# Altium project ESC.PrjPcb
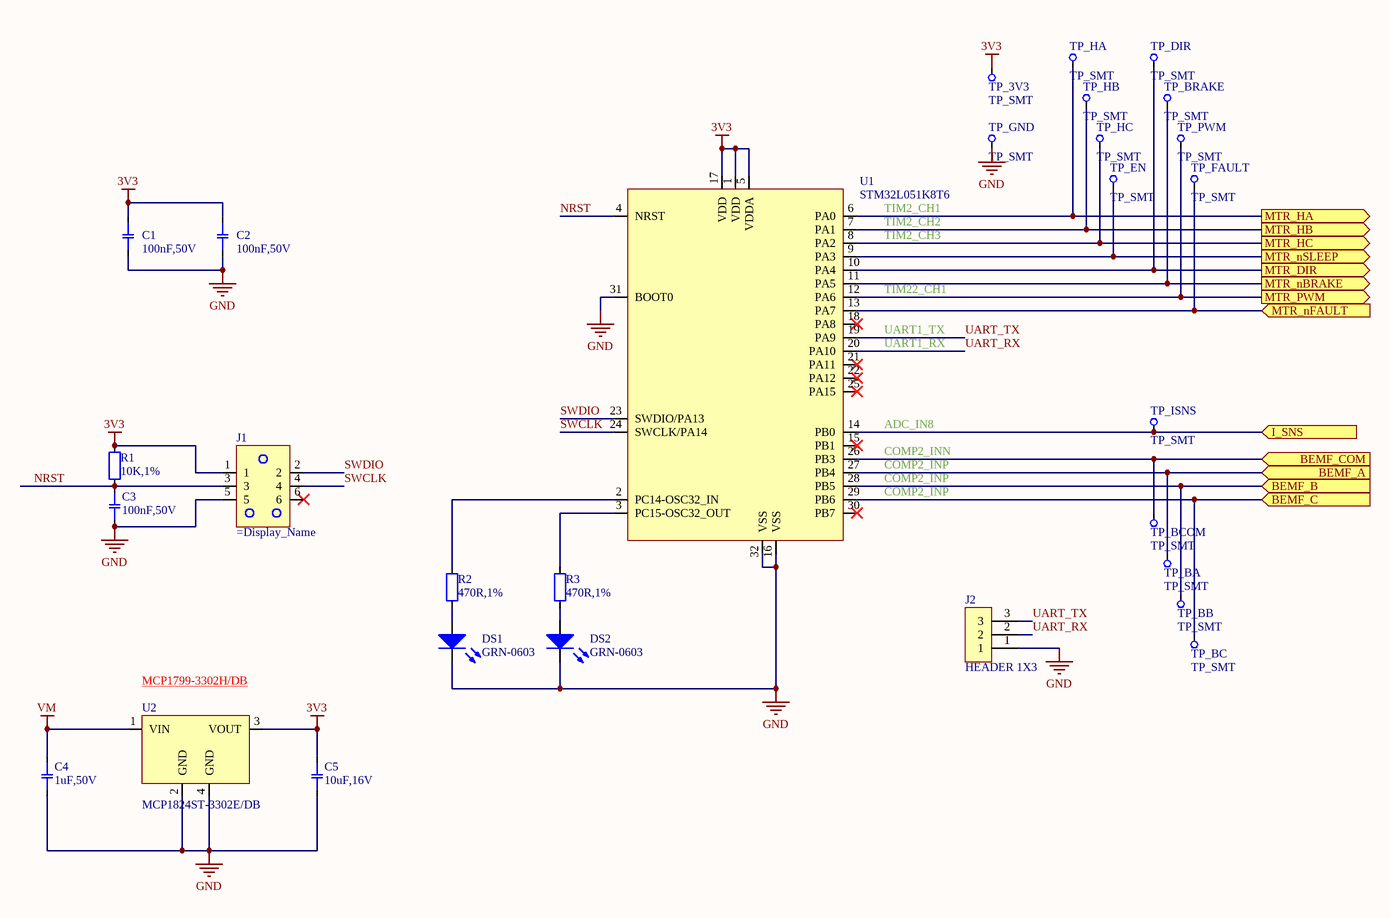
[diagram p0: MCU.SchDoc]
Project_Board_Name: Busmaster; Project_Revision: 1.0
2 sheets, 68 parts. Net scope: flat (ports and power ports of the same name join across sheets).
Board file: ESC.PcbDoc
Sheets:
  MCU.SchDoc
  ESC.SchDoc

## Sheet MCU.SchDoc: Top Level
size A3; CompanyName: NOT USED; DocumentNumber: 1; SheetNumber: 1; SheetTotal: 2; PageSetup: Record=PageOptions|CenterHorizontal=True|CenterVertical=True|PrintScale=1.00|XCorrection=1.00|YCorrection=1.00|PrintKind=0|BorderSize=5000000|LeftOffset=0|BottomOffset=0|Orientation=2|PaperLength=1000|PaperWidth=1000|Scale=100|PaperSource=7|PrintQuality=-4|MediaType=1|DitherType=10|PaperKind=A3|PrintScaleMode=0

### Parts
C1  100nF,50V  [CAPC1608X09N_0603]
C2  100nF,50V  [CAPC1608X09N_0603]
C3  100nF,50V  [CAPC1608X09N_0603]
C4  1uF,50V  [CAPC1608X09N_0603]
C5  10uF,16V  [CAPC2012X12N_0805]
DS1  GRN-0603  [LED_SML-LX0603]
DS2  GRN-0603  [LED_SML-LX0603]
J1  (no value)  [TAG-CONNECT_TC2030-IDC]  (no BOM)
J2  HEADER 1X3  [HIROSE_A2-3PA-2.54DSA]
R1  10K,1%  [RESC1608X06N_0603]
R2  470R,1%  [RESC1608X06N_0603]
R3  470R,1%  [RESC1608X06N_0603]
TP_3V3  TP_SMT  [TP_100X200]
TP_BA  TP_SMT  [TP_100X200]
TP_BB  TP_SMT  [TP_100X200]
TP_BC  TP_SMT  [TP_100X200]
TP_BCOM  TP_SMT  [TP_100X200]
TP_BRAKE  TP_SMT  [TP_100X200]
TP_DIR  TP_SMT  [TP_100X200]
TP_EN  TP_SMT  [TP_100X200]
TP_FAULT  TP_SMT  [TP_100X200]
TP_GND  TP_SMT  [TP_100X200]
TP_HA  TP_SMT  [TP_100X200]
TP_HB  TP_SMT  [TP_100X200]
TP_HC  TP_SMT  [TP_100X200]
TP_ISNS  TP_SMT  [TP_100X200]
TP_PWM  TP_SMT  [TP_100X200]
U1  STM32L051K8T6  [LQFP32]
U2  MCP1824ST-3302E/DB  [SOT230P700X180-4N_SOT223-3]

### Ports
BEMF_A (in), BEMF_B (in), BEMF_C (in), BEMF_COM (in), I_SNS (in), MTR_DIR (out), MTR_HA (out), MTR_HB (out), MTR_HC (out), MTR_nBRAKE (out), MTR_nFAULT (in), MTR_nSLEEP (out), MTR_PWM (out)

### Nets
3V3: C1.2 C2.2 C5.2 J1.1 R1.2 TP_3V3.1 U1.1(VDD) U1.5(VDDA) U1.17(VDD) U2.3(VOUT)
GND: C1.1 C2.1 C3.2 C4.1 C5.1 DS1.1(C) DS2.1(C) J1.5 J2.1 TP_GND.1 U1.16(VSS) U1.31(BOOT0) U1.32(VSS) U2.2(GND) U2.4(GND)
VM: C4.2 U2.1(VIN)
NRST: C3.1 J1.3 R1.1 U1.4(NRST)
SWCLK: J1.4 U1.24(SWCLK/PA14)
SWDIO: J1.2 U1.23(SWDIO/PA13)
UART_RX: J2.2 U1.20(PA10)
UART_TX: J2.3 U1.19(PA9)
NetC15_2: TP_BC.1 U1.29(PB6) ; port BEMF_C
NetC16_2: TP_BB.1 U1.28(PB5) ; port BEMF_B
NetC17_2: TP_BA.1 U1.27(PB4) ; port BEMF_A
NetC18_2: TP_BCOM.1 U1.26(PB3) ; port BEMF_COM
NetC19_1: TP_ISNS.1 U1.14(PB0) ; port I_SNS
NetDS1_2: DS1.2(A) R2.1
NetDS2_2: DS2.2(A) R3.1
NetR2_2: R2.2 U1.2(PC14-OSC32_IN)
NetR3_2: R3.2 U1.3(PC15-OSC32_OUT)
NetTP_BRAKE_1: TP_BRAKE.1 U1.11(PA5) ; port MTR_nBRAKE
NetTP_DIR_1: TP_DIR.1 U1.10(PA4) ; port MTR_DIR
NetTP_EN_1: TP_EN.1 U1.9(PA3) ; port MTR_nSLEEP
NetTP_FAULT_1: TP_FAULT.1 U1.13(PA7) ; port MTR_nFAULT
NetTP_HA_1: TP_HA.1 U1.6(PA0) ; port MTR_HA
NetTP_HB_1: TP_HB.1 U1.7(PA1) ; port MTR_HB
NetTP_HC_1: TP_HC.1 U1.8(PA2) ; port MTR_HC
NetTP_PWM_1: TP_PWM.1 U1.12(PA6) ; port MTR_PWM

Not connected (* = marked no-connect by the designer): J1 6*; U1 15(PB1)* 18(PA8)* 21(PA11)* 22(PA12)* 25(PA15)* 30(PB7)*

### Notes on the sheet
- (near U1) TIM2_CH1
- (near U1) TIM2_CH2
- (near U1) TIM2_CH3
- (near U1) TIM22_CH1
- (near U1) UART1_TX
- (near U1) UART1_RX
- (near U1) COMP2_INN
- (near U1) ADC_IN8
- (near U1) COMP2_INP
- (near U2) MCP1799-3302H/DB <https://www.digikey.co.nz/product-detail/en/microchip-technology/MCP1799-3302H-DB/150-MCP1799-3302H-DB-ND/10491984>
- Project
- Size:
- Date:
- A3
- Revision:
- Sheet
- of
- Lambo
- File:

### Library data of the parts
C1-C3 = CCH-104CH-G: CAP CER 0.1UF 50V 10% X7R 0603; Manufacturer: Kemet; Manufacturer Part Number: C0603C104K5RACTU; Type: Ceramic; Display_Name: 100nF,50V; Capacitance: 100nF; Dielectric: X7R; Tolerance: 10%; Voltage: 50V; BWA PN: CCH-104CH-G; Schematic Symbol: CAP-NP_1; Supplier 1: Digi-Key; Supplier Part Number 1: 399-5089-1-ND
C4 = CCH-106DH-G-A: AUTOMOTIVE CAP CER 1UF 50V 10% X5R 0603; Manufacturer: TDK Corporation; Manufacturer Part Number: CGA3E3X5R1H105K080AB; Type: Ceramic; Display_Name: 1uF,50V; Capacitance: 1uF; Dielectric: X5R; Tolerance: 10%; Voltage: 50V; BWA PN: CCH-106DH-G-A; Schematic Symbol: CAP-NP_1; Supplier 1: Digi-Key; Supplier Part Number 1: 445-7878-1-ND
C5 = CCI-106CE-G: CAP CER 10µF ±10% 16V X7R 0805; Manufacturer: Samsung Electro-Mechanics America, Inc.; Manufacturer Part Number: CL21B106KOQNNNG; Type: Ceramic; Display_Name: 10uF,16V; Capacitance: 10uF; Dielectric: X7R; Tolerance: 10%; Voltage: 16V; BWA PN: CCI-106CE-G; Schematic Symbol: CAP-NP_1; Supplier 1: Digi-Key; Supplier Part Number 1: 1276-6472-1-ND
DS1 DS2 = LED-10087-A: LED GREEN CLEAR 0603 SMD; Manufacturer: Dialight; Manufacturer Part Number: 5988081107F; Wavelength: 523nm; Axial Intensity: 300mcd; If(max): 20mA; Lens Style/Size: 0603; Vf@I: 3.2V; Viewing Angle: 140; Display_Name: GRN-0603; BWA PN: LED-10087-A; Colour: GREEN; Lens type: clear; Vr(max): -; Schematic Symbol: LED_1; Supplier 1: Digi-Key; Supplier Part Number 1: 350-2036-1-ND
J1 = NONPART-051: Tag connect 6 way; Schematic Symbol: TAGCON_TC2030-IDC; BWA PN: NONPART-051
J2 = CON-10038-A: CONN 3-pin 2.54mm pitch TH single row; Manufacturer: Hirose; Manufacturer Part Number: A2-3PA-2.54DSA; Contacts: 3; Rows: 1; Display_Name: HEADER 1X3; Pitch: 2.54mm; Type: HEADER; BWA PN: CON-10038-A; Schematic Symbol: HIROSE_A2-3PA-2.54DSA
R1 = RSH-10K00-D: RES 10.0K OHM 1/10W 1% 0603 SMD; Manufacturer: Yageo; Manufacturer Part Number: RC0603FR-0710KL; Power: 0.1W; Display_Name: 10K,1%; Resistance: 10K; Tolerance: 1%; Type: Chip; BWA PN: RSH-10K00-D; Schematic Symbol: RESISTOR_1; Supplier 1: Digi-Key; Supplier Part Number 1: 311-10.0KHRCT-ND
R2 R3 = RSH-470R0-D: RES 470 OHM 1/10W 1% 0603 SMD; Manufacturer: Rohm Semiconductor; Manufacturer Part Number: MCR03EZPFX4700; Power: 0.1W; Display_Name: 470R,1%; Resistance: 470R; Tolerance: 1%; Type: Chip; BWA PN: RSH-470R0-D; Schematic Symbol: RESISTOR_1; Supplier 1: Digi-Key; Supplier Part Number 1: RHM470HCT-ND
TP_3V3 TP_BA TP_BB TP_BC TP_BCOM TP_BRAKE TP_DIR TP_EN TP_FAULT TP_GND TP_HA TP_HB TP_HC TP_ISNS TP_PWM = NONPART-060: Test Point - SMT; Display_Name: TP_SMT; BWA PN: NONPART-060; Schematic Symbol: TP_1
U1 = ICT-10696-A: 32 Bit Mcirocontroler; Manufacturer: ST Microelectronics; Temp Range: -40°C ~ 85°C; Display_Name: STM32L051K8T6; BWA PN: ICT-10696-A; Schematic Symbol: STM32L051x6/8; Manufacturer Part Number: STM32L051K8T6; Supplier 1: Digi-Key; Supplier Part Number 1: 497-14901-ND
U2 = ICT-10417-A: IC LDO REG 300MA 3.3V SOT223-3; Manufacturer: Microchip Technology; Temp Range: -40°C ~ 125°C; Display_Name: MCP1824ST-3302E/DB; BWA PN: ICT-10417-A; Schematic Symbol: MCP1824ST_DB; Manufacturer Part Number: MCP1824ST-3302E/DB; Supplier 1: Digi-Key; Supplier Part Number 1: MCP1824ST-3302E/DBCT-ND

## Sheet ESC.SchDoc: Top Level
size A3; CompanyName: NOT USED; DocumentNumber: 2; SheetNumber: 2; SheetTotal: 2; PageSetup: Record=PageOptions|CenterHorizontal=True|CenterVertical=True|PrintScale=1.00|XCorrection=1.00|YCorrection=1.00|PrintKind=0|BorderSize=5000000|LeftOffset=0|BottomOffset=0|Orientation=2|PaperLength=1000|PaperWidth=1000|Scale=100|PaperSource=7|PrintQuality=-4|MediaType=1|DitherType=10|PaperKind=A3|PrintScaleMode=0
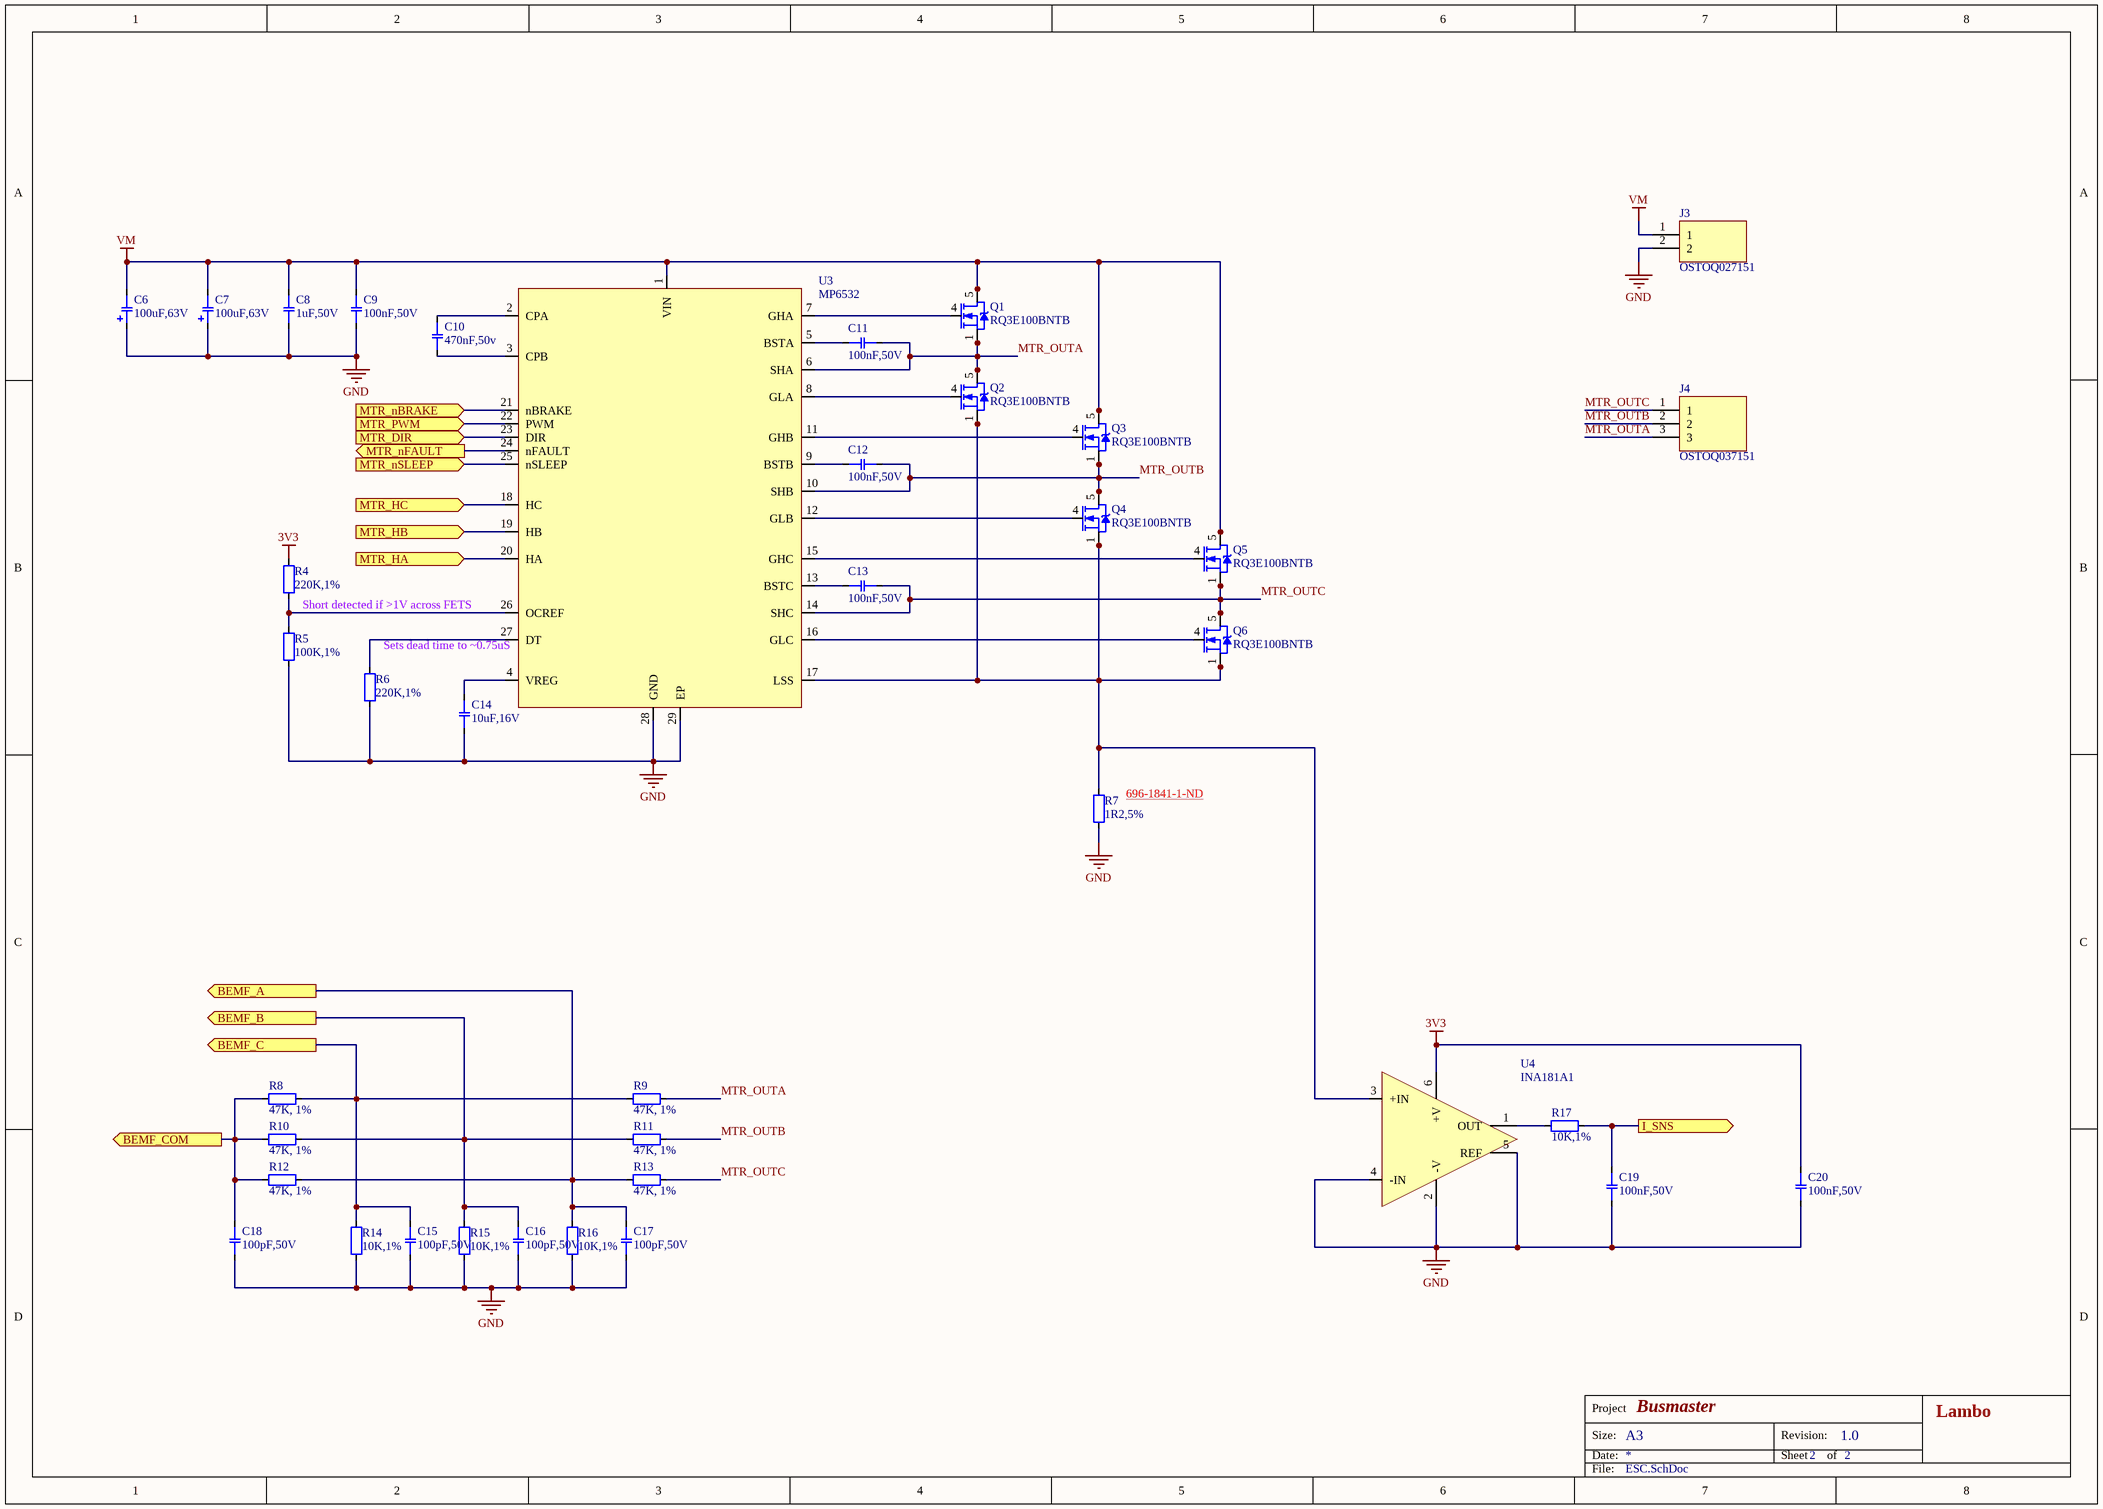
[diagram p1: ESC.SchDoc]

### Parts
C6  100uF,63V  [CAPAE1030X1020N]
C7  100uF,63V  [CAPAE1030X1020N]
C8  1uF,50V  [CAPC1608X09N_0603]
C9  100nF,50V  [CAPC1608X09N_0603]
C10  470nF,50v  [CAPC1608X09N_0603]
C11  100nF,50V  [CAPC1608X09N_0603]
C12  100nF,50V  [CAPC1608X09N_0603]
C13  100nF,50V  [CAPC1608X09N_0603]
C14  10uF,16V  [CAPC2012X12N_0805]
C15  100pF,50V  [CAPC1608X09N_0603]
C16  100pF,50V  [CAPC1608X09N_0603]
C17  100pF,50V  [CAPC1608X09N_0603]
C18  100pF,50V  [CAPC1608X09N_0603]
C19  100nF,50V  [CAPC1608X09N_0603]
C20  100nF,50V  [CAPC1608X09N_0603]
J3  OSTOQ027151  [ONSHORE_OSTOQ027151]
J4  OSTOQ037151  [ONSHORE_OSTOQ037151]
Q1  RQ3E100BNTB  [ROHM-HSMT8]
Q2  RQ3E100BNTB  [ROHM-HSMT8]
Q3  RQ3E100BNTB  [ROHM-HSMT8]
Q4  RQ3E100BNTB  [ROHM-HSMT8]
Q5  RQ3E100BNTB  [ROHM-HSMT8]
Q6  RQ3E100BNTB  [ROHM-HSMT8]
R4  220K,1%  [RESC1608X06N_0603]
R5  100K,1%  [RESC1608X06N_0603]
R6  220K,1%  [RESC1608X06N_0603]
R7  1R2,5%  [RESC6432X07N_2512]
R8  47K, 1%  [RESC1608X06N_0603]
R9  47K, 1%  [RESC1608X06N_0603]
R10  47K, 1%  [RESC1608X06N_0603]
R11  47K, 1%  [RESC1608X06N_0603]
R12  47K, 1%  [RESC1608X06N_0603]
R13  47K, 1%  [RESC1608X06N_0603]
R14  10K,1%  [RESC1608X06N_0603]
R15  10K,1%  [RESC1608X06N_0603]
R16  10K,1%  [RESC1608X06N_0603]
R17  10K,1%  [RESC1608X06N_0603]
U3  MP6532  [QFN40P400X400X100-28N_28QFN]
U4  INA181A1  [SOT95P280X145-6N_SOT23-6]

### Ports
BEMF_A (out), BEMF_B (out), BEMF_C (out), BEMF_COM (out), I_SNS (out), MTR_DIR (in), MTR_HA (in), MTR_HB (in), MTR_HC (in), MTR_nBRAKE (in), MTR_nFAULT (out), MTR_nSLEEP (in), MTR_PWM (in)

### Nets
3V3: C20.1 R4.2 U4.6(+V)
GND: C6.1(+) C7.1(+) C8.1 C9.2 C14.1 C15.1 C16.1 C17.1 C18.1 C19.2 C20.2 J3.2 R5.1 R6.1 R7.1 R14.2 R15.2 R16.2 U3.28(GND) U3.29(EP) U4.2(-V) U4.4(-IN) U4.5(REF)
VM: C6.2(-) C7.2(-) C8.2 C9.1 J3.1 Q1.5(D) Q1.6(D) Q1.7(D) Q1.8(D) Q3.5(D) Q3.6(D) Q3.7(D) Q3.8(D) Q5.5(D) Q5.6(D) Q5.7(D) Q5.8(D) U3.1(VIN)
MTR_OUTA: C11.1 J4.3 Q1.1(S) Q1.2(S) Q1.3(S) Q2.5(D) Q2.6(D) Q2.7(D) Q2.8(D) R9.2 U3.6(SHA)
MTR_OUTB: C12.1 J4.2 Q3.1(S) Q3.2(S) Q3.3(S) Q4.5(D) Q4.6(D) Q4.7(D) Q4.8(D) R11.2 U3.10(SHB)
MTR_OUTC: C13.1 J4.1 Q5.1(S) Q5.2(S) Q5.3(S) Q6.5(D) Q6.6(D) Q6.7(D) Q6.8(D) R13.2 U3.14(SHC)
NetC10_1: C10.1 U3.3(CPB)
NetC10_2: C10.2 U3.2(CPA)
NetC11_2: C11.2 U3.5(BSTA)
NetC12_2: C12.2 U3.9(BSTB)
NetC13_2: C13.2 U3.13(BSTC)
NetC14_2: C14.2 U3.4(VREG)
NetC15_2: C15.2 R8.2 R9.1 R14.1 ; port BEMF_C
NetC16_2: C16.2 R10.2 R11.1 R15.1 ; port BEMF_B
NetC17_2: C17.2 R12.2 R13.1 R16.1 ; port BEMF_A
NetC18_2: C18.2 R8.1 R10.1 R12.1 ; port BEMF_COM
NetC19_1: C19.1 R17.1 ; port I_SNS
NetQ1_4: Q1.4(G) U3.7(GHA)
NetQ2_1: Q2.1(S) Q2.2(S) Q2.3(S) Q4.1(S) Q4.2(S) Q4.3(S) Q6.1(S) Q6.2(S) Q6.3(S) R7.2 U3.17(LSS) U4.3(+IN)
NetQ2_4: Q2.4(G) U3.8(GLA)
NetQ3_4: Q3.4(G) U3.11(GHB)
NetQ4_4: Q4.4(G) U3.12(GLB)
NetQ5_4: Q5.4(G) U3.15(GHC)
NetQ6_4: Q6.4(G) U3.16(GLC)
NetR4_1: R4.1 R5.2 U3.26(OCREF)
NetR6_2: R6.2 U3.27(DT)
NetR17_2: R17.2 U4.1(OUT)
NetTP_BRAKE_1: U3.21(nBRAKE) ; port MTR_nBRAKE
NetTP_DIR_1: U3.23(DIR) ; port MTR_DIR
NetTP_EN_1: U3.25(nSLEEP) ; port MTR_nSLEEP
NetTP_FAULT_1: U3.24(nFAULT) ; port MTR_nFAULT
NetTP_HA_1: U3.20(HA) ; port MTR_HA
NetTP_HB_1: U3.19(HB) ; port MTR_HB
NetTP_HC_1: U3.18(HC) ; port MTR_HC
NetTP_PWM_1: U3.22(PWM) ; port MTR_PWM

### Notes on the sheet
- Short detected if >1V across FETS
- (near U3) Sets dead time to ~0.75uS
- (near R7) 696-1841-1-ND <https://www.digikey.co.nz/product-detail/en/riedon/CSRL3-0R05F8/696-1841-1-ND/9666105>
- Project
- Size:
- Date:
- A3
- Revision:
- Sheet
- of
- Lambo
- File:

### Library data of the parts
C6 C7 = CEG-1070T-H: CAP ALUM 100UF 63V 20% SMD; Manufacturer: Panasonic Electronic Components; Manufacturer Part Number: EEE-FK1J101P; Dielectric: Aluminium; Type: Electrolytic; Display_Name: 100uF,63V; Capacitance: 100uF; Tolerance: 20%; Voltage: 63V; BWA PN: CEG-1070T-H; Schematic Symbol: CAP-POL_1; Supplier 1: Digi-Key; Supplier Part Number 1: PCE3819CT-ND
C8 = CCH-106DH-G-A: as C4 on sheet MCU; Display_Name: 1uF,50V; Capacitance: 1uF; Dielectric: X5R; Tolerance: 10%; Voltage: 50V; BWA PN: CCH-106DH-G-A; Schematic Symbol: CAP-NP_1; Supplier 1: Digi-Key; Supplier Part Number 1: 445-7878-1-ND
C9 C11-C13 C19 C20 = CCH-104CH-G: as C1 on sheet MCU; Display_Name: 100nF,50V; Capacitance: 100nF; Dielectric: X7R; Tolerance: 10%; Voltage: 50V; BWA PN: CCH-104CH-G; Schematic Symbol: CAP-NP_1; Supplier 1: Digi-Key; Supplier Part Number 1: 399-5089-1-ND
C10 = CCH-474DH-G-A: AUTOMOTIVE CAP CER 470nF 50V 10% X5R 0603; Manufacturer: Taiyo Yuden; Manufacturer Part Number: UMK107BJ474KAHT; Type: Ceramic; Display_Name: 470nF,50v; Capacitance: 470nF; Dielectric: X5R; Tolerance: 10%; Voltage: 50V; BWA PN: CCH-474DH-G-A; Schematic Symbol: CAP-NP_1; Supplier 1: Digi-Key; Supplier Part Number 1: 587-3506-1-ND
C14 = CCI-106CE-G: as C5 on sheet MCU; Display_Name: 10uF,16V; Capacitance: 10uF; Dielectric: X7R; Tolerance: 10%; Voltage: 16V; BWA PN: CCI-106CE-G; Schematic Symbol: CAP-NP_1; Supplier 1: Digi-Key; Supplier Part Number 1: 1276-6472-1-ND
C15-C18 = CCH-101AH-G: CAP CER 100PF 50V 10% NP0 0603; Manufacturer: AVX; Manufacturer Part Number: 06035A101KAT2A; Dielectric: C0G,NP0; Type: Ceramic; Display_Name: 100pF,50V; Capacitance: 100pF; Tolerance: 10%; Voltage: 50V; BWA PN: CCH-101AH-G; Schematic Symbol: CAP-NP_1; Supplier 1: Digi-Key; Supplier Part Number 1: 478-3717-1-ND
J3 = CON-10606-A: TERM BLOCK HDR 2POS R/A 5MM; Manufacturer: On Shore Technology Inc; Contacts: 2; Pitch: 5.0; Rows: 1; Display_Name: OSTOQ027151; Series: OQ; Type: HEADER; BWA PN: CON-10606-A; Schematic Symbol: ONSHORE_OSTOQ027151; Manufacturer Part Number: OSTOQ027151; Supplier 1: Digi-Key; Supplier Part Number 1: ED2791-ND
J4 = CON-10607-A: TERM BLOCK HDR 3POS R/A 5MM; Manufacturer: On Shore Technology Inc; Contacts: 3; Pitch: 5.0; Rows: 1; Display_Name: OSTOQ037151; Series: OQ; Type: HEADER; BWA PN: CON-10607-A; Schematic Symbol: ONSHORE_OSTOQ037151; Manufacturer Part Number: OSTOQ037151; Supplier 1: Digi-Key; Supplier Part Number 1: ED2792-ND
Q1-Q6 = TRN-10123-A: MOSFET N-CH 30V 10A 8HSMT; Manufacturer: Rohm Semiconductor; Type: N; rds(on): 10.4mOhm @ 10A, 10V; Vgs(max): ±20V; Vth(max): 2.5V @ 1mA; Display_Name: RQ3E100BNTB; BWA PN: TRN-10123-A; Id(max): 10A; Vds(max): 30V; Schematic Symbol: MOSFET-N-QFN8; Manufacturer Part Number: RQ3E100BNTB; Supplier 1: Digi-Key; Supplier Part Number 1: RQ3E100BNTBCT-ND
R4 R6 = RSH-220K0-D: RES 220K OHM 1/10W 1% 0603 SMD; Manufacturer: Yageo; Manufacturer Part Number: RC0603FR-07220KL; Power: 0.1W; Display_Name: 220K,1%; Resistance: 220K; Tolerance: 1%; Type: Chip; BWA PN: RSH-220K0-D; Schematic Symbol: RESISTOR_1; Supplier 1: Digi-Key; Supplier Part Number 1: 311-220KHRCT-ND
R5 = RSH-100K0-D: RES 100K OHM 1/10W 1% 0603 SMD; Manufacturer: Yageo; Manufacturer Part Number: RC0603FR-07100KL; Power: 0.1W; Display_Name: 100K,1%; Resistance: 100K; Tolerance: 1%; Type: Chip; BWA PN: RSH-100K0-D; Schematic Symbol: RESISTOR_1; Supplier 1: Digi-Key; Supplier Part Number 1: 311-100KHRCT-ND
R7 = RSV-1R200-F: RES SMD 1.2 OHM 5% 3W 2512; Manufacturer: TE Connectivity Passive Product; Manufacturer Part Number: 35221R2JT; Display_Name: 1R2,5%; Power: 3W; Resistance: 1R2; Tolerance: 5%; Type: Chip; BWA PN: RSV-1R200-F; Schematic Symbol: RESISTOR_1; Supplier 1: Digi-Key; Supplier Part Number 1: A121178CT-ND
R8-R13 = RSH-47K00-D-A: AUTOMOTIVE RES 47.0K OHM 1/10W 1% 0603 SMD; Manufacturer: Vishay Dale; Manufacturer Part Number: CRCW060347K0FKEA; Power: 0.1W; Display_Name: 47K, 1%; Resistance: 47k; Tolerance: 1%; Type: Chip; BWA PN: RSH-47K00-D-A; Schematic Symbol: RESISTOR_1; Supplier 1: Digi-Key; Supplier Part Number 1: 541-47.0KHCT-ND
R14-R17 = RSH-10K00-D: as R1 on sheet MCU; Display_Name: 10K,1%; Resistance: 10K; Tolerance: 1%; Type: Chip; BWA PN: RSH-10K00-D; Schematic Symbol: RESISTOR_1; Supplier 1: Digi-Key; Supplier Part Number 1: 311-10.0KHRCT-ND
U3 = ICT-10928-A: IC MOTOR DRIVER 5V-60V 28QFN; Manufacturer: Monolithic Power Systems Inc.; Manufacturer Part Number: MP6532-GR-Z; Temp Range: -40°C ~ 125°C; Display_Name: MP6532; BWA PN: ICT-10928-A; Schematic Symbol: MP6532; Supplier 1: Digi-Key; Supplier Part Number 1: 589-MP6532-GR-ZCT-ND
U4 = ICT-10756-A: IC AMP CUR SENSE 350KHZ SOT23-6; Manufacturer: Texas Instruments; Manufacturer Part Number: INA181A1IDBVT; Temp Range: -40°C ~ 125°C; Display_Name: INA181A1; BWA PN: ICT-10756-A; Schematic Symbol: INA181AX; Supplier 1: Digi-Key; Supplier Part Number 1: 296-46634-1-ND

## Nets that join several sheets
3V3: MCU (10 pins), ESC (C20.1 R4.2 U4.6)
GND: MCU (15 pins), ESC (23 pins)
VM: MCU (C4.2 U2.1), ESC (18 pins)
NetC15_2: MCU (TP_BC.1 U1.29), ESC (C15.2 R8.2 R9.1 R14.1)
NetC16_2: MCU (TP_BB.1 U1.28), ESC (C16.2 R10.2 R11.1 R15.1)
NetC17_2: MCU (TP_BA.1 U1.27), ESC (C17.2 R12.2 R13.1 R16.1)
NetC18_2: MCU (TP_BCOM.1 U1.26), ESC (C18.2 R8.1 R10.1 R12.1)
NetC19_1: MCU (TP_ISNS.1 U1.14), ESC (C19.1 R17.1)
NetTP_BRAKE_1: MCU (TP_BRAKE.1 U1.11), ESC (U3.21)
NetTP_DIR_1: MCU (TP_DIR.1 U1.10), ESC (U3.23)
NetTP_EN_1: MCU (TP_EN.1 U1.9), ESC (U3.25)
NetTP_FAULT_1: MCU (TP_FAULT.1 U1.13), ESC (U3.24)
NetTP_HA_1: MCU (TP_HA.1 U1.6), ESC (U3.20)
NetTP_HB_1: MCU (TP_HB.1 U1.7), ESC (U3.19)
NetTP_HC_1: MCU (TP_HC.1 U1.8), ESC (U3.18)
NetTP_PWM_1: MCU (TP_PWM.1 U1.12), ESC (U3.22)

## Assembly variants
Default: not fitted J2 J3